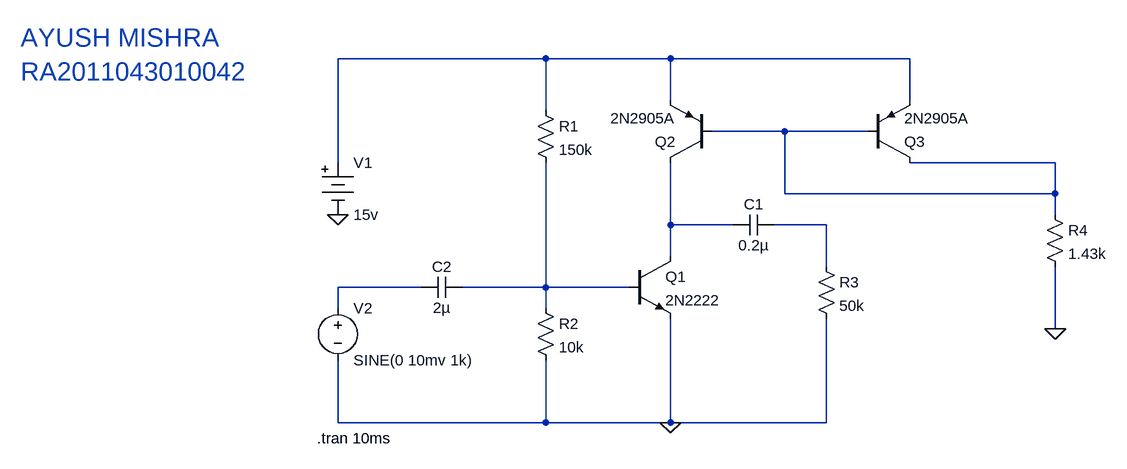
[diagram p0: schematic exp 11b.asc]
exp 11b.asc, the LTspice schematic file:
Version 4
SHEET 1 1016 680
WIRE 144 -160 -176 -160
WIRE 336 -160 144 -160
WIRE 704 -160 336 -160
WIRE 336 -96 336 -160
WIRE 704 -96 704 -160
WIRE 144 -80 144 -160
WIRE 512 -48 400 -48
WIRE 640 -48 512 -48
WIRE -176 0 -176 -160
WIRE 928 0 704 0
WIRE 512 48 512 -48
WIRE 928 48 928 0
WIRE 928 48 512 48
WIRE 928 80 928 48
WIRE 336 96 336 0
WIRE 432 96 336 96
WIRE 576 96 496 96
WIRE 336 144 336 96
WIRE 576 160 576 96
WIRE -48 192 -176 192
WIRE 144 192 144 0
WIRE 144 192 16 192
WIRE 272 192 144 192
WIRE -176 224 -176 192
WIRE 144 224 144 192
WIRE 928 256 928 160
WIRE -176 400 -176 304
WIRE 144 400 144 304
WIRE 144 400 -176 400
WIRE 336 400 336 240
WIRE 336 400 144 400
WIRE 576 400 576 240
WIRE 576 400 336 400
FLAG -176 80 0
FLAG 928 256 0
FLAG 336 400 0
SYMBOL res 128 208 R0
SYMATTR InstName R2
SYMATTR Value 10k
SYMBOL npn 272 144 R0
SYMATTR InstName Q1
SYMATTR Value 2N2222
SYMBOL pnp 400 0 R180
SYMATTR InstName Q2
SYMATTR Value 2N2905A
SYMBOL res 128 -96 R0
SYMATTR InstName R1
SYMATTR Value 150k
SYMBOL cap 496 80 R90
WINDOW 0 0 32 VBottom 2
WINDOW 3 32 32 VTop 2
SYMATTR InstName C1
SYMATTR Value 0.2µ
SYMBOL res 560 144 R0
SYMATTR InstName R3
SYMATTR Value 50k
SYMBOL pnp 640 0 M180
SYMATTR InstName Q3
SYMATTR Value 2N2905A
SYMBOL res 912 64 R0
SYMATTR InstName R4
SYMATTR Value 1.43k
SYMBOL Misc\\battery -176 -16 R0
WINDOW 123 0 0 Left 0
WINDOW 39 0 0 Left 0
SYMATTR InstName V1
SYMATTR Value 15v
SYMBOL voltage -176 208 R0
WINDOW 123 0 0 Left 0
WINDOW 39 0 0 Left 0
SYMATTR InstName V2
SYMATTR Value SINE(0 10mv 1k)
SYMBOL cap 16 176 R90
WINDOW 0 0 32 VBottom 2
WINDOW 3 32 32 VTop 2
SYMATTR InstName C2
SYMATTR Value 2µ
TEXT -208 424 Left 2 !.tran 10ms
TEXT -664 -192 Left 4 ;AYUSH MISHRA\nRA2011043010042

The netlist it stands for:
* exp 11b.asc
R2 N006 0 10k
Q1 N003 N006 0 0 2N2222
Q2 N003 N002 N001 0 2N2905A
R1 N001 N006 150k
C1 N004 N003 0.2µ
R3 N004 0 50k
Q3 N002 N002 N001 0 2N2905A
R4 N002 0 1.43k
V1 N001 0 15v
V2 N005 0 SINE(0 10mv 1k)
C2 N006 N005 2µ
.model NPN NPN
.model PNP PNP
.lib standard.bjt
.tran 10ms
* AYUSH MISHRA
* RA2011043010042
.backanno
.end